# EAGLE design WheeStatX-7 (EAGLE 6.4)
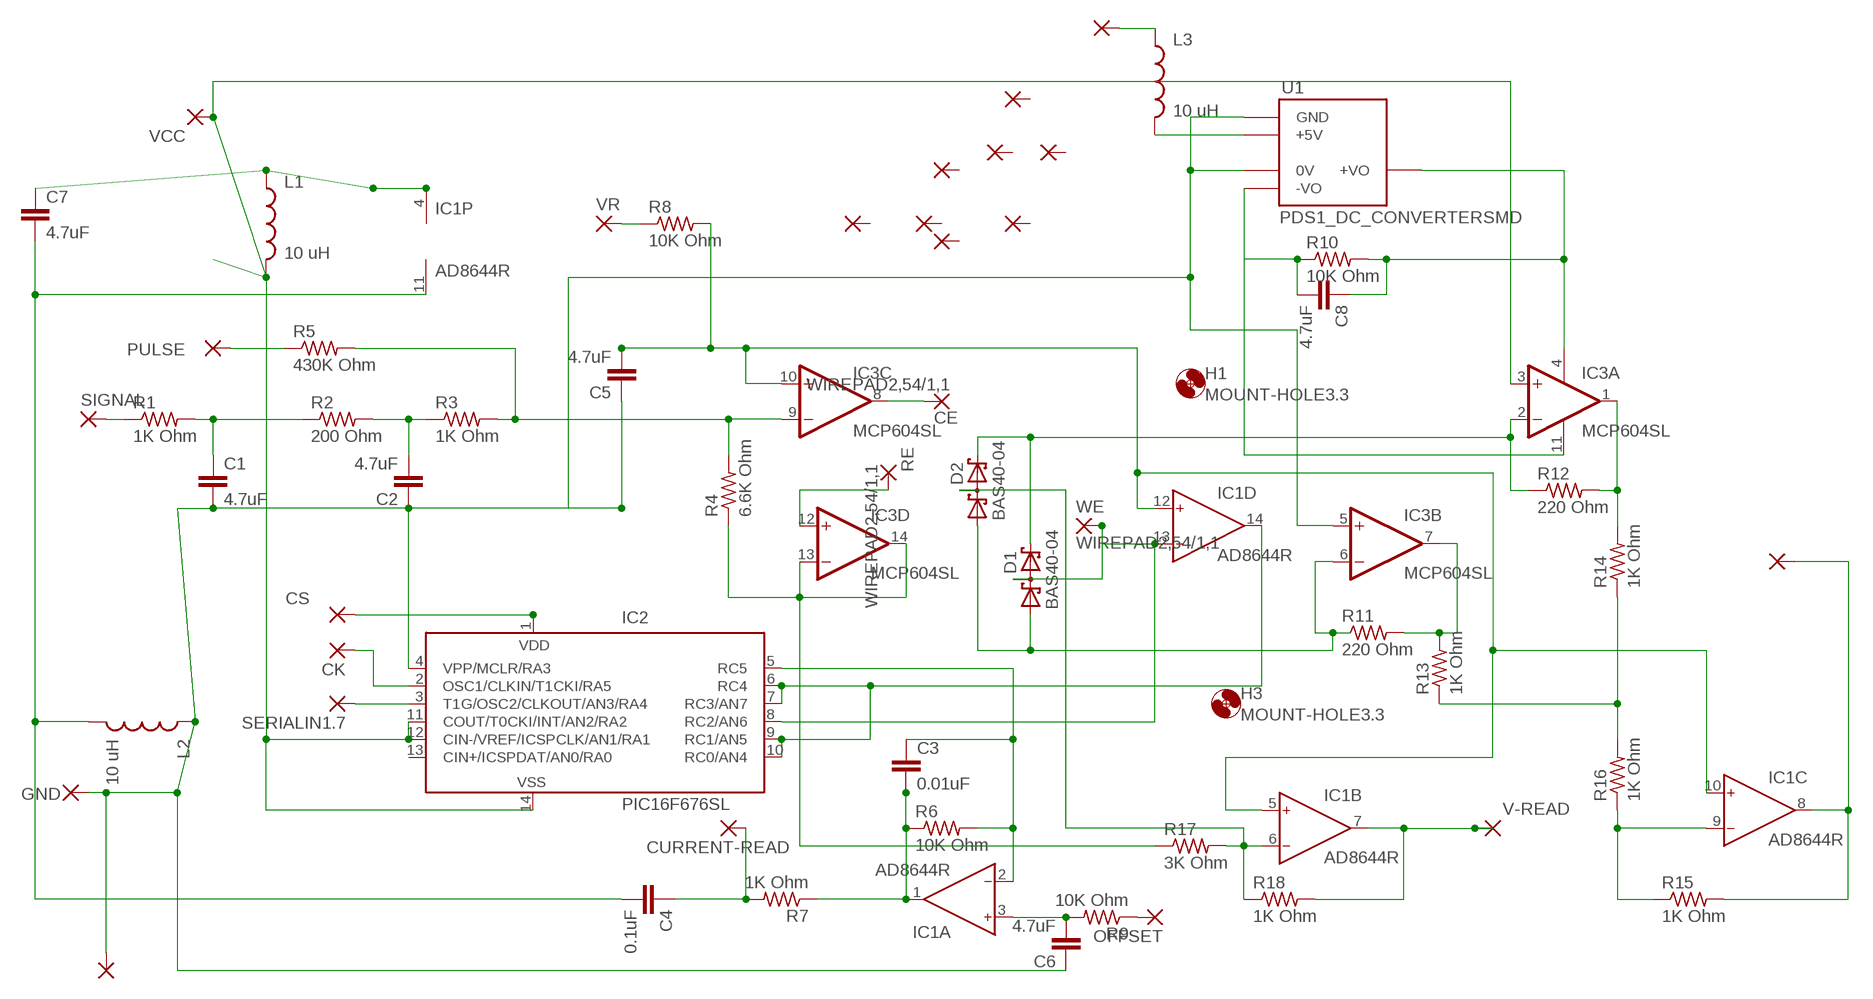
[diagram p0: schematic, sheet 1]

## Parts
1  1,6/0,9  [1,6/0,9]
1.1  1,6/0,9  [1,6/0,9]
1.4  1,6/0,9  [1,6/0,9]
2  1,6/0,9  [1,6/0,9]
3  1,6/0,9  [1,6/0,9]
4  1,6/0,9  [1,6/0,9]
5  1,6/0,9  [1,6/0,9]
6  1,6/0,9  [1,6/0,9]
7  1,6/0,9  [1,6/0,9]
9  1,6/0,9  [1,6/0,9]
10  1,6/0,9  [1,6/0,9]
C1  4.7uF  C-EUC0603  [C0603]
C2  4.7uF  C-EUC0603  [C0603]
C3  0.01uF  C-EUC0603  [C0603]
C4  0.1uF  C-EUC0603  [C0603]
C5  4.7uF  C-EUC0603  [C0603]
C6  4.7uF  C-EUC0603  [C0603]
C7  4.7uF  C-EUC0603  [C0603@1]
C8  4.7uF  C-EUC0603  [C0603]
CE  WIREPAD2,54/1,1  [2,54/1,1]
CK  1,6/0,9  [1,6/0,9]
CS  1,6/0,9  [1,6/0,9]
CURRENT-READ  1,6/0,9  [1,6/0,9]
D1  BAS40-04  [SOT23]
D2  BAS40-04  [SOT23]
GND  1,6/0,9  [1,6/0,9]
H1  MOUNT-HOLE3.3  [3,3]
H3  MOUNT-HOLE3.3  [3,3]
IC1  AD8644R  [SO14]
IC2  PIC16F676SL  [SO-14]
IC3  MCP604SL  [SO14]
L1  10 uH  INDUCTOR0603  [0603]
L2  10 uH  INDUCTOR0603  [0603]
L3  10 uH  INDUCTOR0603  [0603]
OFFSET  1,6/0,9  [1,6/0,9]
PULSE  1,6/0,9  [1,6/0,9]
R1  1K Ohm  R-US_R0603  [R0603]
R2  200 Ohm  R-US_R0603  [R0603]
R3  1K Ohm  R-US_R0603  [R0603]
R4  6.6K Ohm  R-US_R0603  [R0603]
R5  430K Ohm  R-US_R0603  [R0603]
R6  10K Ohm  R-US_R0603  [R0603]
R7  1K Ohm  R-US_R0603  [R0603]
R8  10K Ohm  R-US_R0603  [R0603]
R9  10K Ohm  R-US_R0603  [R0603]
R10  10K Ohm  R-US_R0603  [R0603]
R11  220 Ohm  R-US_R0603  [R0603]
R12  220 Ohm  R-US_R0603  [R0603]
R13  1K Ohm  R-US_R0603  [R0603]
R14  1K Ohm  R-US_R0603  [R0603]
R15  1K Ohm  R-US_R0603  [R0603]
R16  1K Ohm  R-US_R0603  [R0603]
R17  3K Ohm  R-US_R0603  [R0603]
R18  1K Ohm  R-US_R0603  [R0603]
RE  WIREPAD2,54/1,1  [2,54/1,1]
SERIALIN1.7  1,6/0,9  [1,6/0,9]
SIGNAL  1,6/0,9  [1,6/0,9]
U1  PDS1_DC_CONVERTERSMD  [PDS1]
V-READ  1,6/0,9  [1,6/0,9]
VCC  1,6/0,9  [1,6/0,9]
VR  1,6/0,9  [1,6/0,9]
WE  WIREPAD2,54/1,1  [2,54/1,1]

## Nets
GND: 1.1.1(P) C1.2 C2.1 C5.1 C6.1 GND.1(P) IC2.4(VPP/MCLR/RA3) IC3.5(B:+IN) L2.1 U1.1(GND) U1.4(0V)
N$1: IC1.9(C:IN-) R15.1 R16.1
N$2: IC3.13(D:-IN) IC3.14(D:OUT) R4.1 R17.1
N$3: IC3.12(D:+IN) RE.1(P)
N$4: C4.1 CURRENT-READ.1(P) R7.2
N$5: CE.1(P) IC3.8(C:OUT)
N$6: C3.2 IC1.1(A:OUT) R6.1 R7.1
N$7: C5.2 IC1.5(B:IN+) IC1.10(C:IN+) IC1.12(D:IN+) IC3.10(C:+IN) R8.2
N$8: L3.2 U1.2(+5V)
N$9: R1.1 SIGNAL.1(P)
N$11: C4.2 C7.2 IC1.11(P:V-) L2.2
N$12: PULSE.1(P) R5.1
N$13: C1.1 R1.2 R2.1
N$15: CS.1(P) IC2.1(VDD)
N$16: C8.1 IC3.4(P:V+) R10.2 U1.7(+VO)
N$17: D1.3(C1A2) IC1.13(D:IN-) IC2.8(RC2/AN6) WE.1(P)
N$18: IC2.11(COUT/T0CKI/INT/AN2/RA2) IC2.12(CIN-/VREF/ICSPCLK/AN1/RA1) IC2.14(VSS) IC3.3(A:+IN) L1.2 VCC.1(P)
N$19: C2.2 R2.2 R3.1
N$20: IC2.3(T1G/OSC2/CLKOUT/AN3/RA4) SERIALIN1.7.1(P)
N$21: IC3.9(C:-IN) R3.2 R4.2 R5.2
N$22: D1.2(C2) D2.2(C2) IC3.2(A:-IN) R12.1
N$23: IC1.14(D:OUT) IC2.6(RC4) IC2.7(RC3/AN7) IC2.9(RC1/AN5) IC2.10(RC0/AN4)
N$24: CK.1(P) IC2.2(OSC1/CLKIN/T1CKI/RA5)
N$25: C8.2 IC3.11(P:V-) R10.1 U1.5(-VO)
N$26: R13.1 R14.1 R16.2
N$27: 9.1(P) L3.1
N$28: D1.1(A1) D2.1(A1) IC3.6(B:-IN) R11.1
N$30: 1.4.1(P) IC1.8(C:OUT) R15.2
N$31: IC3.7(B:OUT) R11.2 R13.2
N$32: C6.2 IC1.3(A:IN+) R9.2
N$33: OFFSET.1(P) R9.1
N$34: C3.1 IC1.2(A:IN-) IC2.5(RC5) R6.2
N$35: D2.3(C1A2) IC1.6(B:IN-) R17.2 R18.1
N$36: IC3.1(A:OUT) R12.2 R14.2
N$37: R8.1 VR.1(P)
N$38: C7.1 IC1.4(P:V+) L1.1
N$39: IC1.7(B:OUT) R18.2 V-READ.1(P)
Unconnected: 1.1(P) 2.1(P) 3.1(P) 4.1(P) 5.1(P) 6.1(P) 7.1(P) 10.1(P) IC2.13(CIN+/ICSPDAT/AN0/RA0)

## Library data of the parts
1 1.1 1.4 2-7 9 10 CK CS CURRENT-READ GND OFFSET PULSE SERIALIN1.7 SIGNAL V-READ VCC VR = wirepad:1,6/0,9: THROUGH-HOLE PAD
C1-C6 C8 = resistor:C-EU: CAPACITOR, European symbol
C7 = rcl:C-EU: CAPACITOR, European symbol
CE RE WE = wirepad:WIREPAD: Wire PAD connect wire on PCB
D1 D2 = diode:BAS40-04: Silicon Schottky Diodes General-purpose diode for high-speed switching
H1 H3 = holes:MOUNT-HOLE: MOUNTING HOLE with drill center marker
IC1 = analog-devices:AD8644: Single and Quad 18 V Operational Amplifiers Source: http://www.analog.com/static/imported-files/data_sheets/AD8614_8644.pdf; MF: ALTERA CORPORATION; MPN: AD8644ARZ; OC_FARNELL: 1438873; OC_NEWARK: 59K7037
IC2 = microchip:PIC16F676: 14-Pin, Flash-Based 8-Bit CMOS Microcontroller High Performance RISC CPU: * Only 35 instructions to learn - All single-cycle instructions except branches * Operating speed: - DC - 20 MHz oscillator/clock input - DC - 200 ns instruction cycle * Internal and external oscillator options - Precision Internal 4 MHz oscillator factory calibrated to ±1% - External Oscillator support for crystals and resonators - 5?s wake-up from SLEEP, 3.0V, typical * Power saving SLEEP mode * Wide operating voltage range - 2.0V to 5.5V * Industrial and Extended temperature range * Low power Power-on Reset (POR) * Power-up Timer (PWRT) and Oscillator Start-up Timer (OST) * Brown-out Detect (BOD) * Watchdog Timer (WDT) with independent oscillator for reliable operation * Multiplexed MCLR/Input-pin * Interrupt-on-pin change * Individual programmable weak pull-ups * Programmable code protection * High Endurance FLASH/EEPROM Cell - 100,000 write FLASH endurance - 1,000,000 write EEPROM endurance - FLASH/Data EEPROM Retention: > 40 years * Standby Current: - 1 nA @ 2.0V, typical * Operating Current: - 8.5?A @ 32 kHz, 2.0V, typical - 100?A @ 1 MHz, 2.0V, typical * Watchdog Timer Current - 300 nA @ 2.0V, typical * Timer1 oscillator current: - 4?A @ 32 kHz, 2.0V, typical * 12 I/O pins with individual direction control * High current sink/source for direct LED drive * Analog-to-Digital Converter module (PIC16F676): - 10-bit resolution - Programmable 8-channel input - Voltage reference input * In-Circuit Serial ProgrammingTM (ICSPTM) via two pins Source: http://ww1.microchip.com/downloads/en/DeviceDoc/40039E.pdf; MF: MICROCHIP; MPN: PIC16F676-I/SL; OC_FARNELL: 9760520; OC_NEWARK: 92C4557
IC3 = linear:MCP604: Quad Op Amp 2.7V to 6.0V Single Supply CMOS Source: http://ww1.microchip.com/downloads/en/DeviceDoc/21314g.pdf
L1-L3 = SparkFun-Passives:INDUCTOR: Inductors Basic Inductor/Choke - 0603 and 1206. Footprints are not proven and vary greatly between part numbers. SRN6045- 33uH, 20% 1.4A SDR0403-560KL - 56uH, 10%, 500mA RMS/740mA peak
R1-R18 = resistor:R-US_: RESISTOR, American symbol
U1 = JackLibrary:PDS1_DC_CONVERTER: CUI Inc Series PDA1-M DC DC Converter

## Board
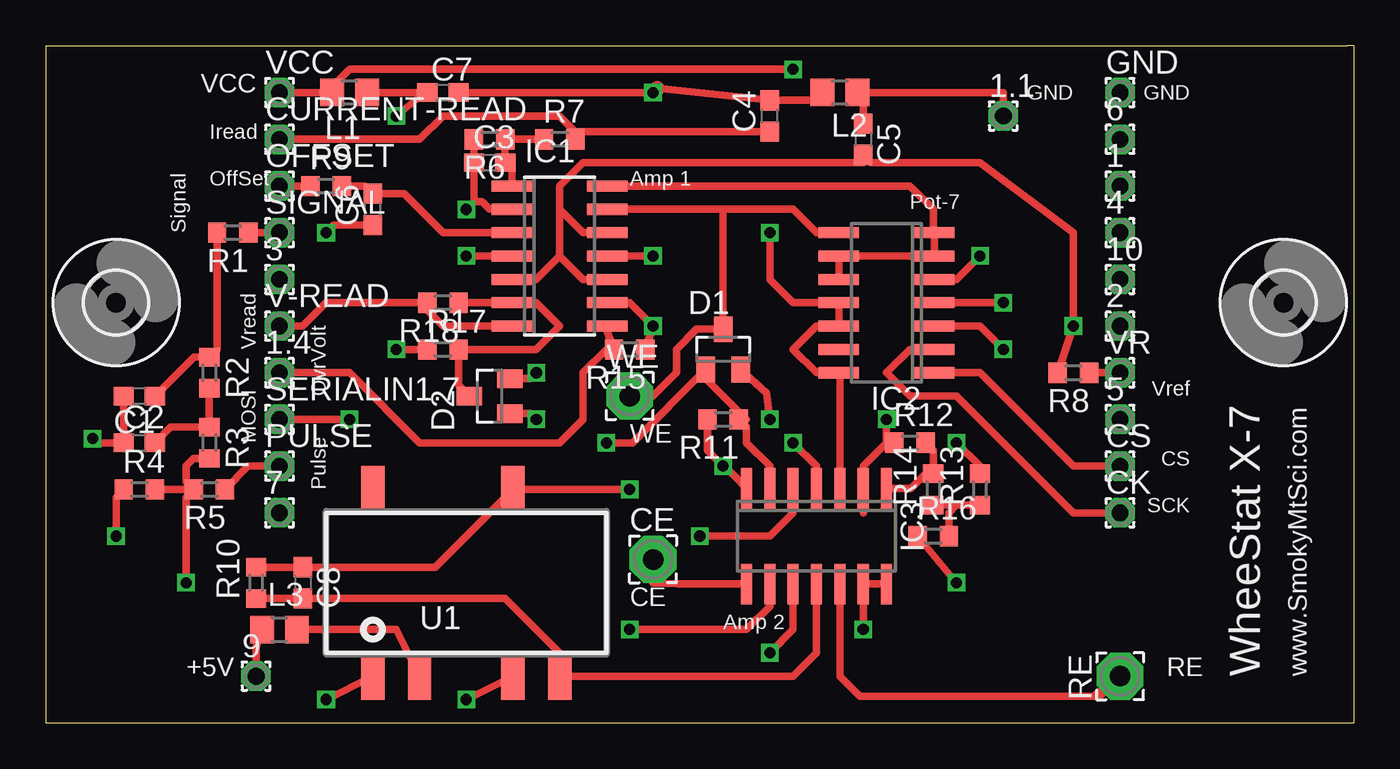
[diagram p1: board, top side]
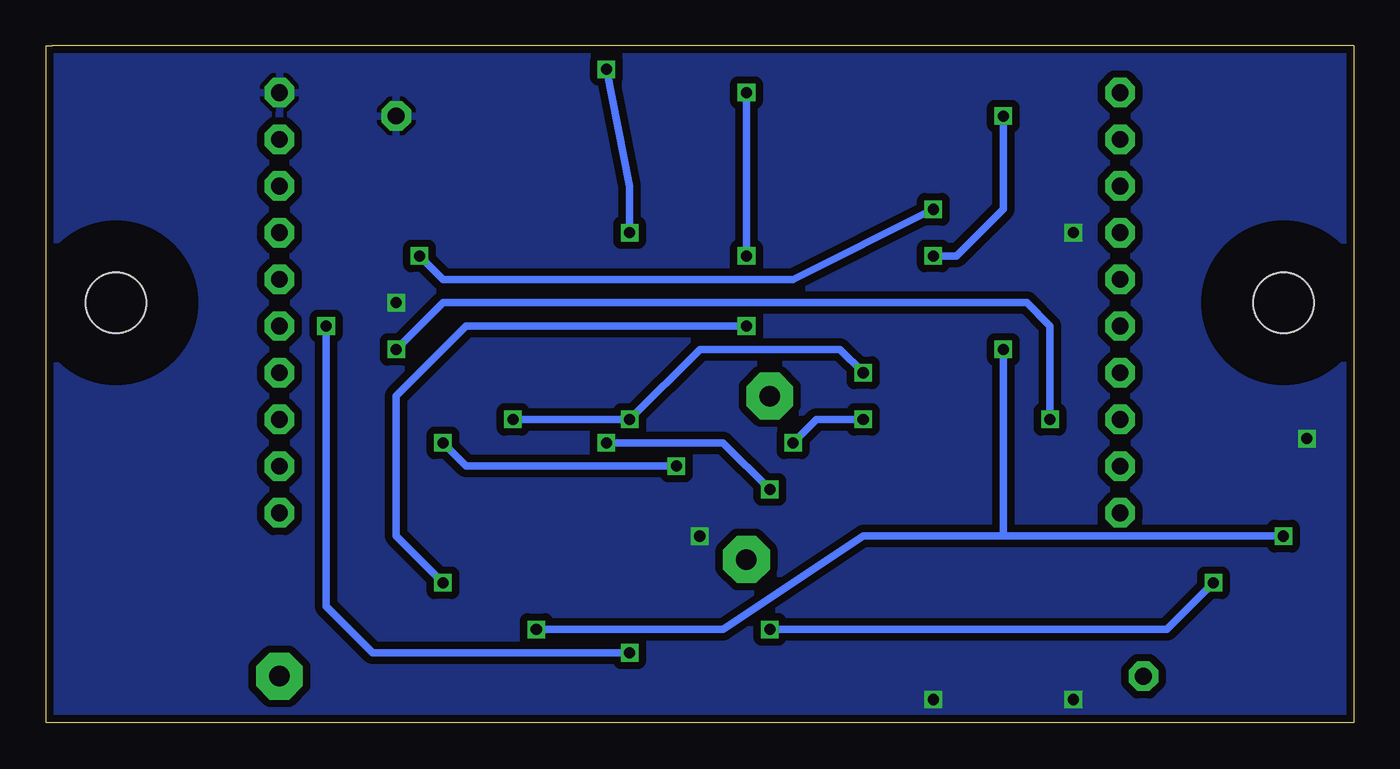
[diagram p2: board, bottom side, seen from below]

Size 71.12 x 36.83 mm. Coordinates in mm from the lower left corner, seen from the top.
Outline: 0,36.83 0,0 71.12,0 71.12,36.83 70.79,36.83 0,36.83
Copper layers (1*16): Top 0.035mm / dielectric 1.5mm / Bottom 0.035mm
Design rules "default *": minimum track width 6mil, minimum drill 13mil, track to track 6mil, track to pad 6mil, pad to pad 6mil, via to via 8mil, smd to smd 6mil, copper to edge 15mil, drill to drill 6mil, minimum pad ring 7mil, minimum via ring 7mil, stop-mask expansion 4mil, vias tented up to drill 0mil, thermal gap 10mil

### Footprints (pad centres in the part's own frame; a part is rotated, then mirrored left to right if it is on the bottom)
1,6/0,9 = drill 0.914 pad 1.6 octagon: 1 0,0
C0603 = smd 1.1 x 1: 1 -0.85,0; 2 0.85,0
2,54/1,1 = drill 1.118 pad 2.54 octagon: 1 0,0
SOT23 = smd 1 x 1.4: 1 -0.95,-1.1; 2 0.95,-1.1; 3 0,1.1
3,3 = hole 3.3: 0,0
SO14 = smd 0.6 x 2.2: 1 -3.81,-2.6; 2 -2.54,-2.6; 3 -1.27,-2.6; 4 0,-2.6; 5 1.27,-2.6; 6 2.54,-2.6; 7 3.81,-2.6; 8 3.81,2.6; 9 2.54,2.6; 10 1.27,2.6; 11 0,2.6; 12 -1.27,2.6; 13 -2.54,2.6; 14 -3.81,2.6
SO-14 = smd 0.6 x 2.2: 1 -3.81,-2.6; 2 -2.54,-2.6; 3 -1.27,-2.6; 4 0,-2.6; 5 1.27,-2.6; 6 2.54,-2.6; 7 3.81,-2.6; 8 3.81,2.6; 9 2.54,2.6; 10 1.27,2.6; 11 0,2.6; 12 -1.27,2.6; 13 -2.54,2.6; 14 -3.81,2.6
R0805 = smd 1.3 x 1.5: 1 -0.95,0; 2 0.95,0
R0603 = smd 1 x 1.1: 1 -0.85,0; 2 0.85,0
PDS1 = smd 1.27 x 2.54: 1 -5.08,-5.08; 2 -2.54,-5.08; 4 2.54,-5.08; 5 5.08,-5.08; 7 2.54,5.08; 10 -5.08,5.08

### Placement (x,y rotation side)
1  58.42,29.21 0 top
1.1  52.07,33.02 0 top
1.4  12.7,19.05 0 top
2  58.42,21.59 0 top
3  12.7,24.13 0 top
4  58.42,26.67 0 top
5  58.42,16.51 0 top
6  58.42,31.75 0 top
7  12.7,11.43 0 top
9  11.43,2.54 0 top
10  58.42,24.13 0 top
C1  5.08,17.78 180 top
C2  5.08,15.24 0 top
C3  24.13,30.48 0 top
C4  39.37,33.02 90 top
C5  44.45,31.75 270 top
C6  17.78,27.94 90 top
C7  4.7uF  [C0603]  21.59,34.29 0 top
C8  13.97,7.62 270 top
CE  33.02,8.89 0 top
CK  58.42,11.43 0 top
CS  58.42,13.97 0 top
CURRENT-READ  12.7,31.75 0 top
D1  36.83,20.32 0 top
D2  24.13,17.78 90 top
GND  58.42,34.29 0 top
H1  3.81,22.86 0 top
H3  67.31,22.86 0 top
IC1  27.94,25.4 270 top
IC2  45.72,22.86 90 top
IC3  41.91,10.16 180 top
L1  10 uH  [R0805]  16.51,34.29 180 top
L2  10 uH  [R0805]  43.18,34.29 180 top
L3  10 uH  [R0805]  12.7,5.08 0 top
OFFSET  12.7,29.21 0 top
PULSE  12.7,13.97 0 top
R1  10.16,26.67 180 top
R2  8.89,19.05 270 top
R3  8.89,15.24 269.8 top
R4  5.08,12.7 0 top
R5  8.89,12.7 180.2 top
R6  24.13,31.75 180 top
R7  27.94,31.75 0 top
R8  55.88,19.05 180 top
R9  15.24,29.21 0 top
R10  11.43,7.62 90 top
R11  36.83,16.51 180 top
R12  46.99,15.24 0 top
R13  50.8,12.7 90 top
R14  48.26,12.7 90 top
R15  31.75,20.32 180 top
R16  48.26,10.16 0 top
R17  21.59,20.32 0 top
R18  21.59,22.86 180 top
RE  58.42,2.54 90 top
SERIALIN1.7  12.7,16.51 0 top
SIGNAL  12.7,26.67 0 top
U1  22.86,7.62 0 top
V-READ  12.7,21.59 0 top
VCC  12.7,34.29 0 top
VR  58.42,19.05 0 top
WE  31.75,17.78 0 top

### Tracks (layer width: path | path; a pad name or v marks a point on that pad's centre or on a via)
GND  (via drill 0.6)
  Top 0.406: IC3.5 40.64,11.43 39.37,10.16 v35.56,10.16 | IC2.4 v52.07,22.86 | U1.4 v22.86,1.27 | 1.1.1 52.07,34.29 L2.1 44.45,33.97 C5.1 | v2.54,15.47 2.77,15.24 C2.1 C1.2 | U1.1 v15.24,1.27 | C6.1 15.66,27.09 v15.24,26.67
  pour Bottom (isolate 0.406): 0,0 0,36.83 71.12,36.83 71.12,0
N$1  (via drill 0.6)
  Top 0.406: IC1.9 31.75,22.86 v33.02,21.59 R15.1 | v49.53,7.62 R16.1
  Bottom 0.406: v33.02,21.59 48.26,21.59 52.07,17.78 52.07,10.16 v49.53,7.62
N$2  (via drill 0.6)
  Top 0.406: v3.81,10.16 3.81,12.28 R4.1 | IC3.13 44.45,7.62 | IC3.13 v44.45,5.08 | v19.05,20.32 R17.1 | IC3.14 IC3.13
  Bottom 0.406: v44.45,5.08 34.29,5.08 26.67,10.16 19.05,10.16 | v3.81,10.16 19.05,10.16 | v19.05,20.32 19.05,10.16
N$3
  Top 0.406: IC3.12 43.18,2.54 44.28,1.44 57.32,1.44 RE.1 56.98,1.44
N$4
  Top 0.406: CURRENT-READ.1 20.32,31.75 21.59,33.02 27.94,33.02 28.79,32.17 29.21,32.17 | C4.1 29.21,32.17 | 29.21,32.17 R7.2
N$5
  Top 0.406: IC3.8 34.35,7.56 33.02,7.62 CE.1
N$6
  Top 0.406: R7.1 R6.1 C3.2 25.34,30.12 IC1.1
N$7  (via drill 0.6)
  Top 0.406: IC1.12 29.21,26.67 27.94,27.94 | 27.94,27.94 27.94,29.21 29.21,30.48 44.45,30.48 C5.2 44.87,30.48 50.8,30.48 55.88,26.67 v55.88,21.59 R8.2 | IC1.5 26.67,24.13 27.94,25.4 | 27.94,25.4 27.94,27.94 | IC1.10 29.21,24.13 27.94,25.4 | IC3.10 40.64,5.08 v39.37,3.81
  Bottom 0.406: v55.88,21.59 55.88,6.35 53.34,3.81 v39.37,3.81
N$8
  Top 0.406: L3.2 19.05,5.08 U1.2
N$9
  Top 0.406: SIGNAL.1 R1.1
N$11  (via drill 0.6)
  Top 0.406: C7.2 v33.02,34.29 | 33.25,34.52 C4.2 41.81,33.87 L2.2 | IC1.11 v33.02,25.4
  Top 0.813: 33.25,34.52 v33.02,34.29
  Bottom 0.406: v33.02,34.29 v33.02,25.4
N$12
  Top 0.406: PULSE.1 11.01,13.97 R5.1
N$13
  Top 0.406: C1.1 8.05,19.9 R2.1 9.31,20.32 R1.2
N$15
  Top 0.406: IC2.1 50.8,19.05 55.88,13.97 CS.1
N$16  (via drill 0.6)
  Top 0.406: 41.91,12.7 IC3.4 41.91,13.97 v40.64,15.24 | v31.75,12.7 U1.7 21.17,8.47 C8.1 R10.2
  Bottom 0.406: v40.64,15.24 34.29,15.24 v31.75,12.7
N$17
  Top 0.406: IC2.8 41.91,26.67 40.64,27.94 36.83,27.94 | 36.83,27.94 IC1.13 | 36.83,27.94 D1.3 35.39,21.42 34.29,20.32 34.29,19.05 33.02,17.78 WE.1
N$18  (via drill 0.6)
  Top 0.406: 43.18,12.7 IC3.3 43.18,18.99 IC2.14 41.91,19.05 40.64,20.32 41.91,21.59 IC2.12 IC2.11 40.64,22.86 39.37,24.13 v39.37,26.67 | VCC.1 15.24,34.29 | 15.24,34.29 L1.2 | 15.24,34.29 16.51,35.56 v40.64,35.56
  Bottom 0.406: v40.64,35.56 39.37,29.21 v39.37,26.67
N$19
  Top 0.406: R2.2 R3.1 6.78,16.09 C2.2
N$20  (via drill 0.6)
  Top 0.406: SERIALIN1.7.1 v16.51,16.51 | IC2.3 50.8,21.59 v52.07,20.32
  Bottom 0.406: v16.51,16.51 16.51,21.59 17.78,22.86 49.53,22.86 v52.07,20.32
N$21  (via drill 0.6)
  Top 0.406: R5.2 7.62,12.7 | R5.2 R4.2 | R3.2 8.04,14.39 7.62,13.97 7.62,13.12 R5.2 | IC3.9 39.37,6.35 38.1,5.08 v31.75,5.08 | v7.62,7.62 7.62,12.28 R5.2
  Bottom 0.406: v31.75,5.08 10.16,5.08 v7.62,7.62
N$22  (via drill 0.6)
  Top 0.406: R12.1 45.72,15.24 | 44.45,11.43 IC3.2 44.45,13.97 45.72,15.24 | 45.72,15.24 v45.72,16.51 | D1.2 39.2,17.95 v39.37,16.51 | D2.2 26.35,18.73 v26.67,19.05
  Bottom 0.406: v45.72,16.51 v39.37,16.51 35.56,20.32 27.94,20.32 v26.67,19.05
N$23
  Top 0.406: IC2.10 IC2.9 IC2.6 IC2.7 48.26,26.73 | 48.26,26.67 48.26,26.73 | 48.26,26.73 48.26,27.94 46.99,29.21 IC1.14
N$24
  Top 0.406: CK.1 55.88,11.43 49.53,17.78 46.99,17.78 45.72,19.05 46.99,20.32 IC2.2
N$25
  Top 0.406: IC3.11 41.91,3.81 40.64,2.54 U1.5 27.94,3.81 24.98,6.77 C8.2 R10.1
N$26
  Top 0.406: R14.1 49.53,11.85 | 49.53,11.85 R13.1 | R16.2 49.11,11.43 49.53,11.85
N$27
  Top 0.406: 9.1 11.43,4.13 L3.1
N$28  (via drill 0.6)
  Top 0.406: 39.37,12.7 IC3.6 39.37,13.97 38.1,15.24 38.1,16.09 R11.1 38.1,16.51 35.88,18.73 D1.1 31.9,15.24 v30.48,15.24 | D2.1 26.35,16.83 v26.67,16.51
  Bottom 0.406: v26.67,16.51 29.21,16.51 v30.48,15.24
N$30
  Top 0.406: 1.4.1 16.51,19.05 20.32,15.24 27.94,15.24 29.21,16.51 29.21,19.05 30.48,20.32 R15.2 30.54,21.23 IC1.8
N$31  (via drill 0.6)
  Top 0.406: IC3.7 36.89,14.03 v36.83,13.97 35.98,14.82 R11.2 | R13.2 50.8,13.97 v49.53,15.24
  Bottom 0.406: v36.83,13.97 48.26,13.97 v49.53,15.24
N$32
  Top 0.406: IC1.3 21.59,26.67 19.47,28.79 C6.2 17.36,29.21 R9.2
N$33
  Top 0.406: OFFSET.1 R9.1
N$34  (via drill 0.6)
  Top 0.406: IC2.5 49.53,24.13 v50.8,25.4 | R6.2 C3.1 23.28,28.36 | 23.28,28.36 v22.86,27.94 | 23.28,28.36 23.71,28.36 24.13,27.94 IC1.2
  Bottom 0.406: v50.8,25.4 49.53,24.13 30.48,24.13 v22.86,27.94
N$35
  Top 0.406: IC1.6 25.4,22.86 | IC1.6 R18.1 | IC1.6 26.67,22.86 27.94,21.59 26.67,20.32 R17.2 22.44,18.37 D2.3
N$36
  Top 0.406: IC3.1 47.05,12.76 48.26,13.97 | 48.26,13.97 R14.2 | 48.26,13.97 48.26,14.82 R12.2
N$37
  Top 0.406: VR.1 R8.1
N$38  (via drill 0.6)
  Top 0.406: L1.1 C7.1 20.32,34.06 v19.05,33.02 | IC1.4 v22.86,25.4
  Bottom 0.406: v19.05,33.02 19.05,27.94 21.59,25.4 v22.86,25.4
N$39
  Top 0.406: 20.32,22.86 15.24,22.86 13.97,21.59 V-READ.1 | IC1.7 21.59,21.59 20.32,22.86 | 20.32,22.86 R18.2

### Text on the board
tPlace: VCC | GND | GND | Iread | OffSet | Amp 1 | Pot-7 | Signal | Vread | OvrVolt | Vref | MOSI | WE | CS | Pulse | SCK | CE | Amp 2 | +5V | RE | WheeStat X-7 | www.SmokyMtSci.com